# EAGLE schematic Interface_EPROM_Kte (EAGLE 7.6.0)
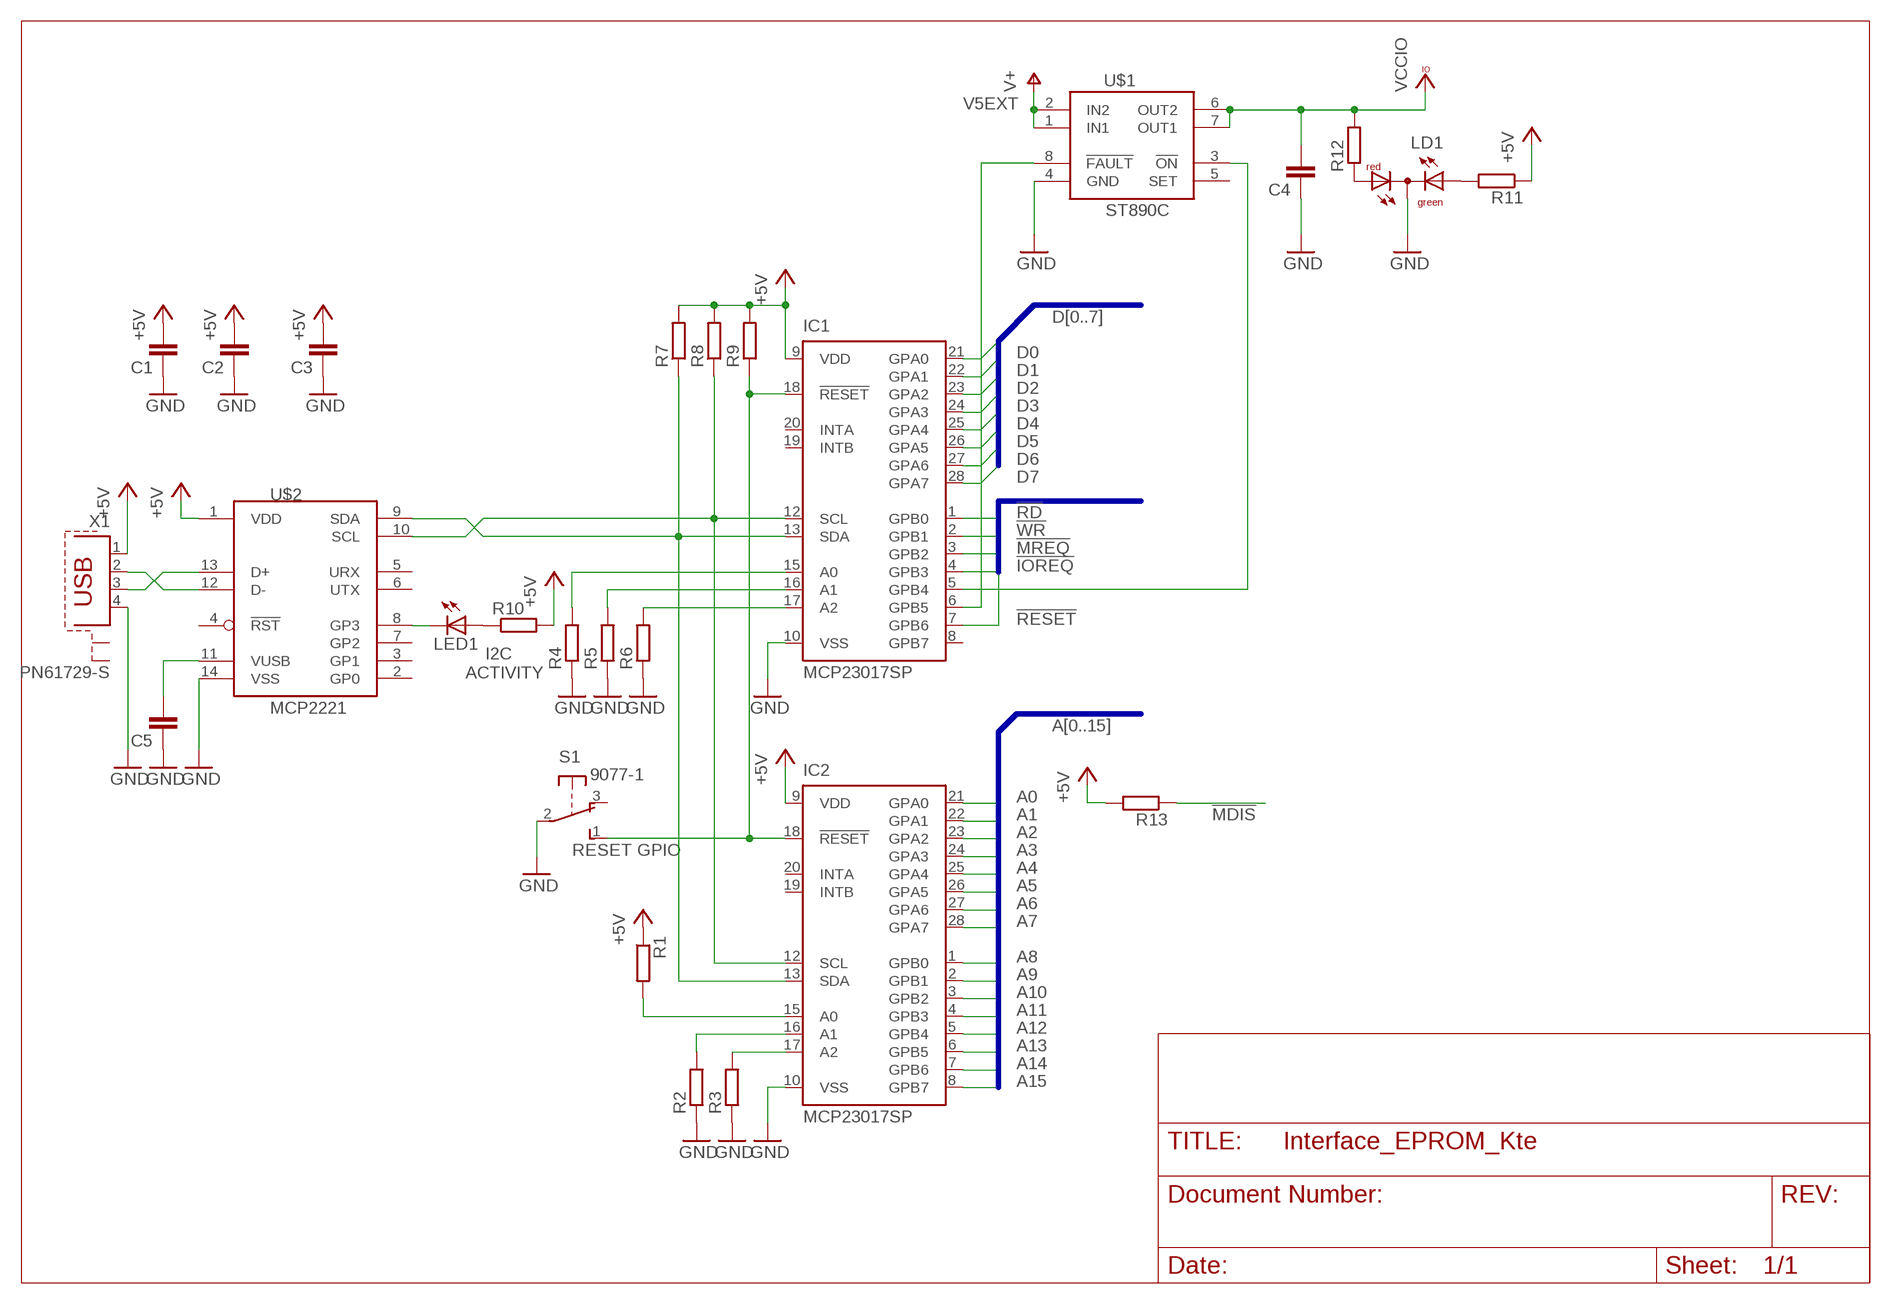
[diagram p0: schematic, sheet 1]

## Parts
C1  C-EUC0805  [C0805]
C2  C-EUC0805  [C0805]
C3  C-EUC0805  [C0805]
C4  C-EUC0805  [C0805]
C5  C-EUC0805  [C0805]
IC1  MCP23017SP  [DIL28-3]
IC2  MCP23017SP  [DIL28-3]
LD1  DUOLED-RG-C  [DUOLED-C-5MM]
LED1  LED3MM  [LED3MM]
R1  R-EU_R0805  [R0805]
R2  R-EU_R0805  [R0805]
R3  R-EU_R0805  [R0805]
R4  R-EU_R0805  [R0805]
R5  R-EU_R0805  [R0805]
R6  R-EU_R0805  [R0805]
R7  R-EU_R0805  [R0805]
R8  R-EU_R0805  [R0805]
R9  R-EU_R0805  [R0805]
R10  R-EU_R0805  [R0805]
R11  R-EU_R0805  [R0805]
R12  R-EU_R0805  [R0805]
R13  R-EU_R0805  [R0805]
S1  9077-1  [9077-1]
U$1  ST890C  [SO-08]
U$2  MCP2221  [DIL14]
X1  PN61729-S  [PN61729-S]

## Nets
!IOREQ: IC1.4(GPB3)
!MDIS: R13.1
!MREQ: IC1.3(GPB2)
!RD: IC1.1(GPB0)
!RESET: IC1.7(GPB6)
!WR: IC1.2(GPB1)
+5V: C1.2 C2.2 C3.2 IC1.9(VDD) IC2.9(VDD) R1.1 R7.2 R8.2 R9.2 R10.2 R11.1 R13.2 U$2.1(VDD) X1.1
A0: IC2.21(GPA0)
A1: IC2.22(GPA1)
A2: IC2.23(GPA2)
A3: IC2.24(GPA3)
A4: IC2.25(GPA4)
A5: IC2.26(GPA5)
A6: IC2.27(GPA6)
A7: IC2.28(GPA7)
A8: IC2.1(GPB0)
A9: IC2.2(GPB1)
A10: IC2.3(GPB2)
A11: IC2.4(GPB3)
A12: IC2.5(GPB4)
A13: IC2.6(GPB5)
A14: IC2.7(GPB6)
A15: IC2.8(GPB7)
D0: IC1.21(GPA0)
D1: IC1.22(GPA1)
D2: IC1.23(GPA2)
D3: IC1.24(GPA3)
D4: IC1.25(GPA4)
D5: IC1.26(GPA5)
D6: IC1.27(GPA6)
D7: IC1.28(GPA7)
GND: C1.1 C2.1 C3.1 C4.1 C5.1 IC1.10(VSS) IC2.10(VSS) LD1.C R2.1 R3.1 R4.1 R5.1 R6.1 S1.2(P) U$1.4(GND) U$2.14(VSS) X1.4
I2C_ACT: LED1.K(C) U$2.8(GP3)
I2C_SCL: IC1.12(SCL) IC2.12(SCL) R8.1 U$2.10(SCL)
I2C_SDA: IC1.13(SDA) IC2.13(SDA) R7.1 U$2.9(SDA)
N$1: IC2.15(A0) R1.2
N$2: IC2.16(A1) R2.2
N$3: IC2.17(A2) R3.2
N$4: IC1.15(A0) R4.2
N$5: IC1.16(A1) R5.2
N$6: IC1.17(A2) R6.2
N$7: IC1.18(!RESET) IC2.18(!RESET) R9.1 S1.1(S)
N$8: LED1.A R10.1
N$11: LD1.AX(AG) R11.2
N$12: LD1.AR R12.1
PWR_EXT_FAULT: IC1.6(GPB5) U$1.8(!FAULT)
PWR_EXT_ON: IC1.5(GPB4) U$1.3(!ON)
USB_D+: U$2.13(D+) X1.3
USB_D-: U$2.12(D-) X1.2
V5EXT: U$1.1(IN1) U$1.2(IN2) ; supply symbol labelled V+
VCCIO: C4.2 R12.2 U$1.6(OUT2) U$1.7(OUT1)
VUSB: C5.2 U$2.11(VUSB)
Unconnected: IC1.8(GPB7) IC1.19(INTB) IC1.20(INTA) IC2.19(INTB) IC2.20(INTA) S1.3(O) U$1.5(SET) U$2.2(GP0) U$2.3(GP1) U$2.4(!RST) U$2.5(URX) U$2.6(UTX) U$2.7(GP2) X1.S1 X1.S2

## Buses
A[0..15]
D[0..7]
STB:!IOREQ,!MREQ,!RD,!WR,!RESET,!MDIS

## Notes on the sheet
- I2C
  ACTIVITY
- RESET GPIO

## Library data of the parts
C1-C5 = resistor:C-EU: CAPACITOR, European symbol
IC1 IC2 = microchip:MCP23017: http://ww1.microchip.com/downloads/en/DeviceDoc/21952a.pdf Source: http://ww1.microchip.com/downloads/en/DeviceDoc/21952a.pdf; MF: MICROCHIP; MPN: MCP23017-E/SP; OC_FARNELL: 1332088; OC_NEWARK: 31K2959
LD1 = led:DUOLED-RG-C: DUO LED 2 colors (red/green), 5 mm, round, common Cathode www.ligitek.com or other producers.
LED1 = led:LED: LED OSRAM: - CHIPLED LG R971, LG N971, LY N971, LG Q971, LY Q971, LO R971, LY R971 LH N974, LH R974 LS Q976, LO Q976, LY Q976 LO Q996 - Hyper CHIPLED LW Q18S LB Q993, LB Q99A, LB R99A - SideLED LS A670, LO A670, LY A670, LG A670, LP A670 LB A673, LV A673, LT A673, LW A673 LH A674 LY A675 LS A676, LA A676, LO A676, LY A676, LW A676 LS A679, LY A679, LG A679 - Hyper Micro SIDELED® LS Y876, LA Y876, LO Y876, LY Y876 LT Y87S - SmartLED LW L88C, LW L88S LB L89C, LB L89S, LG L890 LS L89K, LO L89K, LY L89K LS L896, LA L896, LO L896, LY L896 - TOPLED LS T670, LO T670, LY T670, LG T670, LP T670 LSG T670, LSP T670, LSY T670, LOP T670, LYG T670 LG T671, LOG T671, LSG T671 LB T673, LV T673, LT T673, LW T673 LH T674 LS T676, LA T676, LO T676, LY T676, LB T676, LH T676, LSB T676, LW T676 LB T67C, LV T67C, LT T67C, LS T67K, LO T67K, LY T67K, LW E67C LS E67B, LA E67B, LO E67B, LY E67B, LB E67C, LV E67C, LT E67C LW T67C LS T679, LY T679, LG T679 LS T770, LO T770, LY T770, LG T770, LP T770 LB T773, LV T773, LT T773, LW T773 LH T774 LS E675, LA E675, LY E675, LS T675 LS T776, LA T776, LO T776, LY T776, LB T776 LHGB T686 LT T68C, LB T68C - Hyper Mini TOPLED® LB M676 - Mini TOPLED Santana® LG M470 LS M47K, LO M47K, LY M47K Source: http://www.osram.convergy.de LUXEON: - LUMILED® LXK2-PW12-R00, LXK2-PW12-S00, LXK2-PW14-U00, LXK2-PW14-V00 LXK2-PM12-R00, LXK2-PM12-S00, LXK2-PM14-U00 LXK2-PE12-Q00, LXK2-PE12-R00, LXK2-PE12-S00, LXK2-PE14-T00, LXK2-PE14-U00 LXK2-PB12-K00, LXK2-PB12-L00, LXK2-PB12-M00, LXK2-PB14-N00, LXK2-PB14-P00, LXK2-PB14-Q00 LXK2-PR12-L00, LXK2-PR12-M00, LXK2-PR14-Q00, LXK2-PR14-R00 LXK2-PD12-Q00, LXK2-PD12-R00, LXK2-PD12-S00 LXK2-PH12-R00, LXK2-PH12-S00 LXK2-PL12-P00, LXK2-PL12-Q00, LXK2-PL12-R00 Source: www.luxeon.com KINGBRIGHT: KA-3528ASYC Source: www.kingbright.com
R1-R13 = resistor:R-EU_: RESISTOR, European symbol
S1 = switch-misc:9077-1: MARQUARDT SWITCH 9077.0100 Distributor: Buerklin <https://www.buerklin.com/default.asp?event=ShowArtikel%2812G2820%29&l=d&jump=ArtNr_12G2820>
U$1 = ST890:ST890C
U$2 = ronny:MCP2221
X1 = con-berg:PN61729-S: BERG USB connector; OC_FARNELL: unknown; OC_NEWARK: unknown